# EAGLE design LiTE INO 2.2 rev. 01 (GND Plan) (EAGLE 9.0.1)
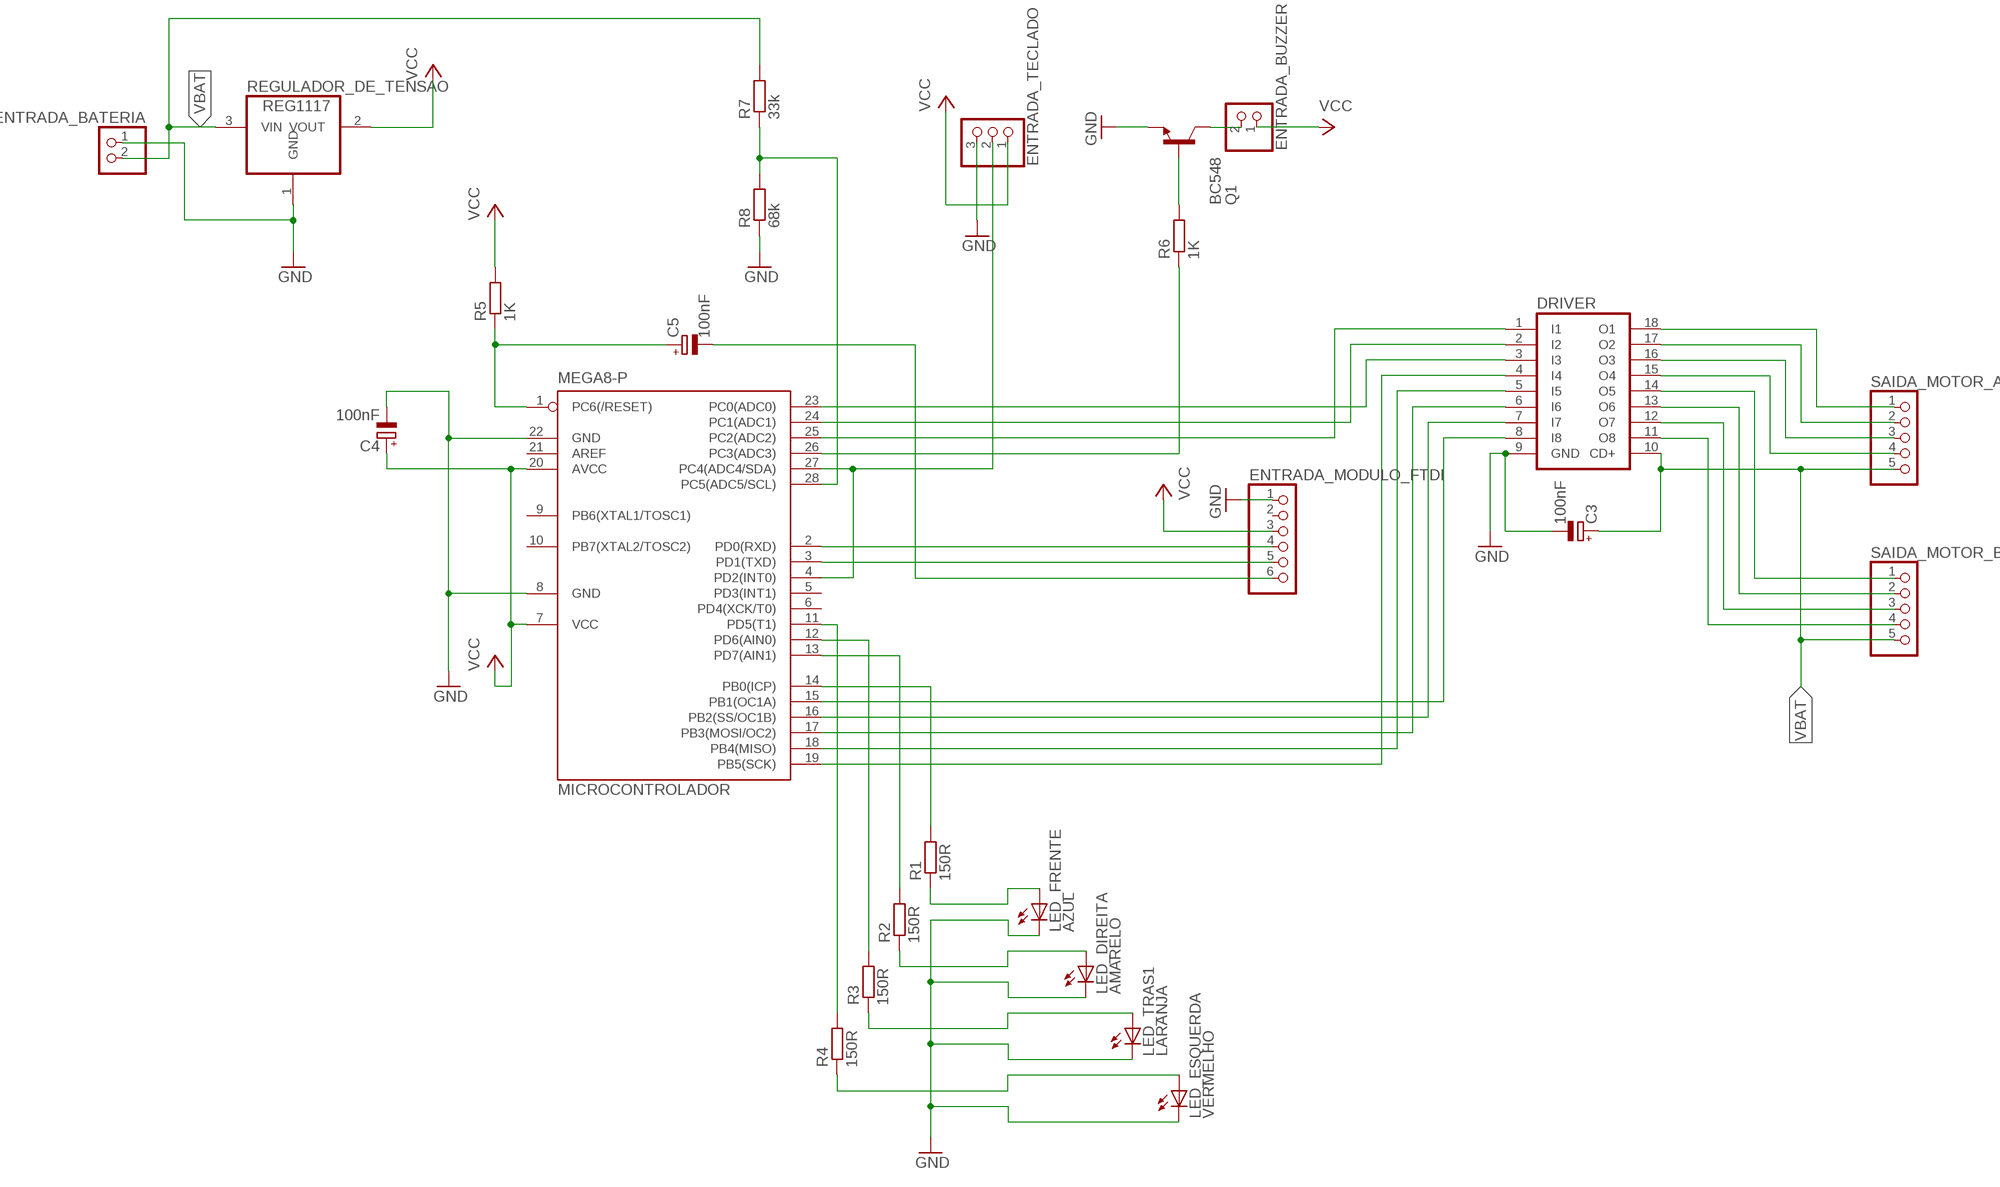
[diagram p0: schematic, sheet 1]

## Parts
C3  100nF  CPOL-EUE5-5  [E5-5]
C4  100nF  CPOL-EUE5-5  [E5-5]
C5  100nF  CPOL-EUE5-5  [E5-5]
DRIVER  ULN2803A  [DIL18]
ENTRADA_BATERIA  PINHD-1X2/90  [1X02/90]
ENTRADA_BUZZER  PINHD-1X2/90  [1X02/90]
ENTRADA_MODULO_FTDI  PINHD-1X6/90  [1X06/90]
ENTRADA_TECLADO  PINHD-1X3/90  [1X03/90]
LED_DIREITA  AMARELO  LED5MM  [LED5MM]
LED_ESQUERDA  VERMELHO  LED5MM  [LED5MM]
LED_FRENTE  AZUL  LED5MM  [LED5MM]
LED_TRAS1  LARANJA  LED5MM  [LED5MM]
MICROCONTROLADOR  MEGA8-P  [DIL28-3]
Q1  BC548  [TO92-EBC]
R1  150R  R-EU_0204/7  [0204/7]
R2  150R  R-EU_0204/7  [0204/7]
R3  150R  R-EU_0204/7  [0204/7]
R4  150R  R-EU_0204/7  [0204/7]
R5  1K  R-EU_0204/7  [0204/7]
R6  1K  R-EU_0204/7  [0204/7]
R7  33k  R-EU_0204/7  [0204/7]
R8  68k  R-EU_0204/7  [0204/7]
REGULADOR_DE_TENSAO  REG1117  [SOT223]
SAIDA_MOTOR_A  PINHD-1X5/90  [1X05/90]
SAIDA_MOTOR_B  PINHD-1X5/90  [1X05/90]

## Nets
GND: C3.- C4.- DRIVER.9(GND) ENTRADA_BATERIA.1 ENTRADA_MODULO_FTDI.1 ENTRADA_TECLADO.3 LED_DIREITA.K(C) LED_ESQUERDA.K(C) LED_FRENTE.K(C) LED_TRAS1.K(C) MICROCONTROLADOR.8(GND) MICROCONTROLADOR.22(GND) Q1.E R8.1 REGULADOR_DE_TENSAO.1(GND)
N$1: DRIVER.1(I1) MICROCONTROLADOR.25(PC2(ADC2))
N$2: DRIVER.2(I2) MICROCONTROLADOR.24(PC1(ADC1))
N$3: DRIVER.3(I3) MICROCONTROLADOR.23(PC0(ADC0))
N$4: DRIVER.4(I4) MICROCONTROLADOR.19(PB5(SCK))
N$5: DRIVER.5(I5) MICROCONTROLADOR.18(PB4(MISO))
N$6: DRIVER.6(I6) MICROCONTROLADOR.17(PB3(MOSI/OC2))
N$7: DRIVER.7(I7) MICROCONTROLADOR.16(PB2(SS/OC1B))
N$8: DRIVER.8(I8) MICROCONTROLADOR.15(PB1(OC1A))
N$9: LED_FRENTE.A R1.1
N$10: DRIVER.18(O1) SAIDA_MOTOR_A.1
N$11: DRIVER.17(O2) SAIDA_MOTOR_A.2
N$12: DRIVER.16(O3) SAIDA_MOTOR_A.3
N$13: DRIVER.15(O4) SAIDA_MOTOR_A.4
N$14: LED_DIREITA.A R2.1
N$15: DRIVER.14(O5) SAIDA_MOTOR_B.1
N$16: DRIVER.13(O6) SAIDA_MOTOR_B.2
N$17: DRIVER.12(O7) SAIDA_MOTOR_B.3
N$18: DRIVER.11(O8) SAIDA_MOTOR_B.4
N$19: LED_TRAS1.A R3.1
N$20: MICROCONTROLADOR.14(PB0(ICP)) R1.2
N$21: MICROCONTROLADOR.13(PD7(AIN1)) R2.2
N$22: MICROCONTROLADOR.12(PD6(AIN0)) R3.2
N$23: MICROCONTROLADOR.11(PD5(T1)) R4.2
N$24: ENTRADA_TECLADO.2 MICROCONTROLADOR.4(PD2(INT0)) MICROCONTROLADOR.27(PC4(ADC4/SDA))
N$25: ENTRADA_BUZZER.2 Q1.C
N$27: MICROCONTROLADOR.28(PC5(ADC5/SCL)) R7.1 R8.2
N$28: LED_ESQUERDA.A R4.1
N$29: MICROCONTROLADOR.26(PC3(ADC3)) R6.1
N$30: ENTRADA_MODULO_FTDI.4 MICROCONTROLADOR.2(PD0(RXD))
N$31: ENTRADA_MODULO_FTDI.5 MICROCONTROLADOR.3(PD1(TXD))
N$32: C5.- ENTRADA_MODULO_FTDI.6
N$33: C5.+ MICROCONTROLADOR.1(PC6(/RESET)) R5.1
N$34: Q1.B R6.2
VBAT: C3.+ DRIVER.10(CD+) ENTRADA_BATERIA.2 R7.2 REGULADOR_DE_TENSAO.3(VIN) SAIDA_MOTOR_A.5 SAIDA_MOTOR_B.5
VCC: C4.+ ENTRADA_BUZZER.1 ENTRADA_MODULO_FTDI.3 ENTRADA_TECLADO.1 MICROCONTROLADOR.7(VCC) MICROCONTROLADOR.20(AVCC) R5.2 REGULADOR_DE_TENSAO.2(VOUT)
Unconnected: ENTRADA_MODULO_FTDI.2 MICROCONTROLADOR.5(PD3(INT1)) MICROCONTROLADOR.6(PD4(XCK/T0)) MICROCONTROLADOR.9(PB6(XTAL1/TOSC1)) MICROCONTROLADOR.10(PB7(XTAL2/TOSC2)) MICROCONTROLADOR.21(AREF)

## Library data of the parts
C3-C5 = rcl:CPOL-EU: POLARIZED CAPACITOR, European symbol; SPICEPREFIX: C
DRIVER = uln-udn:ULN2803A: DRIVER ARRAY
ENTRADA_BATERIA ENTRADA_BUZZER = pinhead:PINHD-1X2: PIN HEADER
ENTRADA_MODULO_FTDI = pinhead:PINHD-1X6: PIN HEADER
ENTRADA_TECLADO = pinhead:PINHD-1X3: PIN HEADER
LED_DIREITA LED_ESQUERDA LED_FRENTE LED_TRAS1 = led:LED: LED OSRAM: - CHIPLED LG R971, LG N971, LY N971, LG Q971, LY Q971, LO R971, LY R971 LH N974, LH R974 LS Q976, LO Q976, LY Q976 LO Q996 - Hyper CHIPLED LW Q18S LB Q993, LB Q99A, LB R99A - SideLED LS A670, LO A670, LY A670, LG A670, LP A670 LB A673, LV A673, LT A673, LW A673 LH A674 LY A675 LS A676, LA A676, LO A676, LY A676, LW A676 LS A679, LY A679, LG A679 - Hyper Micro SIDELED® LS Y876, LA Y876, LO Y876, LY Y876 LT Y87S - SmartLED LW L88C, LW L88S LB L89C, LB L89S, LG L890 LS L89K, LO L89K, LY L89K LS L896, LA L896, LO L896, LY L896 - TOPLED LS T670, LO T670, LY T670, LG T670, LP T670 LSG T670, LSP T670, LSY T670, LOP T670, LYG T670 LG T671, LOG T671, LSG T671 LB T673, LV T673, LT T673, LW T673 LH T674 LS T676, LA T676, LO T676, LY T676, LB T676, LH T676, LSB T676, LW T676 LB T67C, LV T67C, LT T67C, LS T67K, LO T67K, LY T67K, LW E67C LS E67B, LA E67B, LO E67B, LY E67B, LB E67C, LV E67C, LT E67C LW T67C LS T679, LY T679, LG T679 LS T770, LO T770, LY T770, LG T770, LP T770 LB T773, LV T773, LT T773, LW T773 LH T774 LS E675, LA E675, LY E675, LS T675 LS T776, LA T776, LO T776, LY T776, LB T776 LHGB T686 LT T68C, LB T68C - Hyper Mini TOPLED® LB M676 - Mini TOPLED Santana® LG M470 LS M47K, LO M47K, LY M47K Source: http://www.osram.convergy.de LUXEON: - LUMILED® LXK2-PW12-R00, LXK2-PW12-S00, LXK2-PW14-U00, LXK2-PW14-V00 LXK2-PM12-R00, LXK2-PM12-S00, LXK2-PM14-U00 LXK2-PE12-Q00, LXK2-PE12-R00, LXK2-PE12-S00, LXK2-PE14-T00, LXK2-PE14-U00 LXK2-PB12-K00, LXK2-PB12-L00, LXK2-PB12-M00, LXK2-PB14-N00, LXK2-PB14-P00, LXK2-PB14-Q00 LXK2-PR12-L00, LXK2-PR12-M00, LXK2-PR14-Q00, LXK2-PR14-R00 LXK2-PD12-Q00, LXK2-PD12-R00, LXK2-PD12-S00 LXK2-PH12-R00, LXK2-PH12-S00 LXK2-PL12-P00, LXK2-PL12-Q00, LXK2-PL12-R00 Source: www.luxeon.com KINGBRIGHT: KA-3528ASYC Source: www.kingbright.com
MICROCONTROLADOR = atmel:MEGA8-P: MICROCONTROLLER 8 Kbytes FLASH, 1 kbytes SRAM, 512 bytes EEPROM, USART, 4-channel 10 bit ADC, 2-channel 8 bit ADC Pin compatible with Atmega48, ATMega88, ATMega168 Source: avr.lbr; OC_FARNELL: unknown; OC_NEWARK: unknown
Q1 = transistor-npn:BC548*: NPN Transistor
R1-R8 = resistor:R-EU_: RESISTOR, European symbol
REGULADOR_DE_TENSAO = burr-brown:REG1117: 800mA and 1A Low Dropout (LDO) Positive Regulator 1.8V, 2.5V, 2.85V, 3.3V, 5V, and Adj; MPN: REG1117; OC_FARNELL: 1097566; OC_NEWARK: 14P6981
SAIDA_MOTOR_A SAIDA_MOTOR_B = pinhead:PINHD-1X5: PIN HEADER

## Board
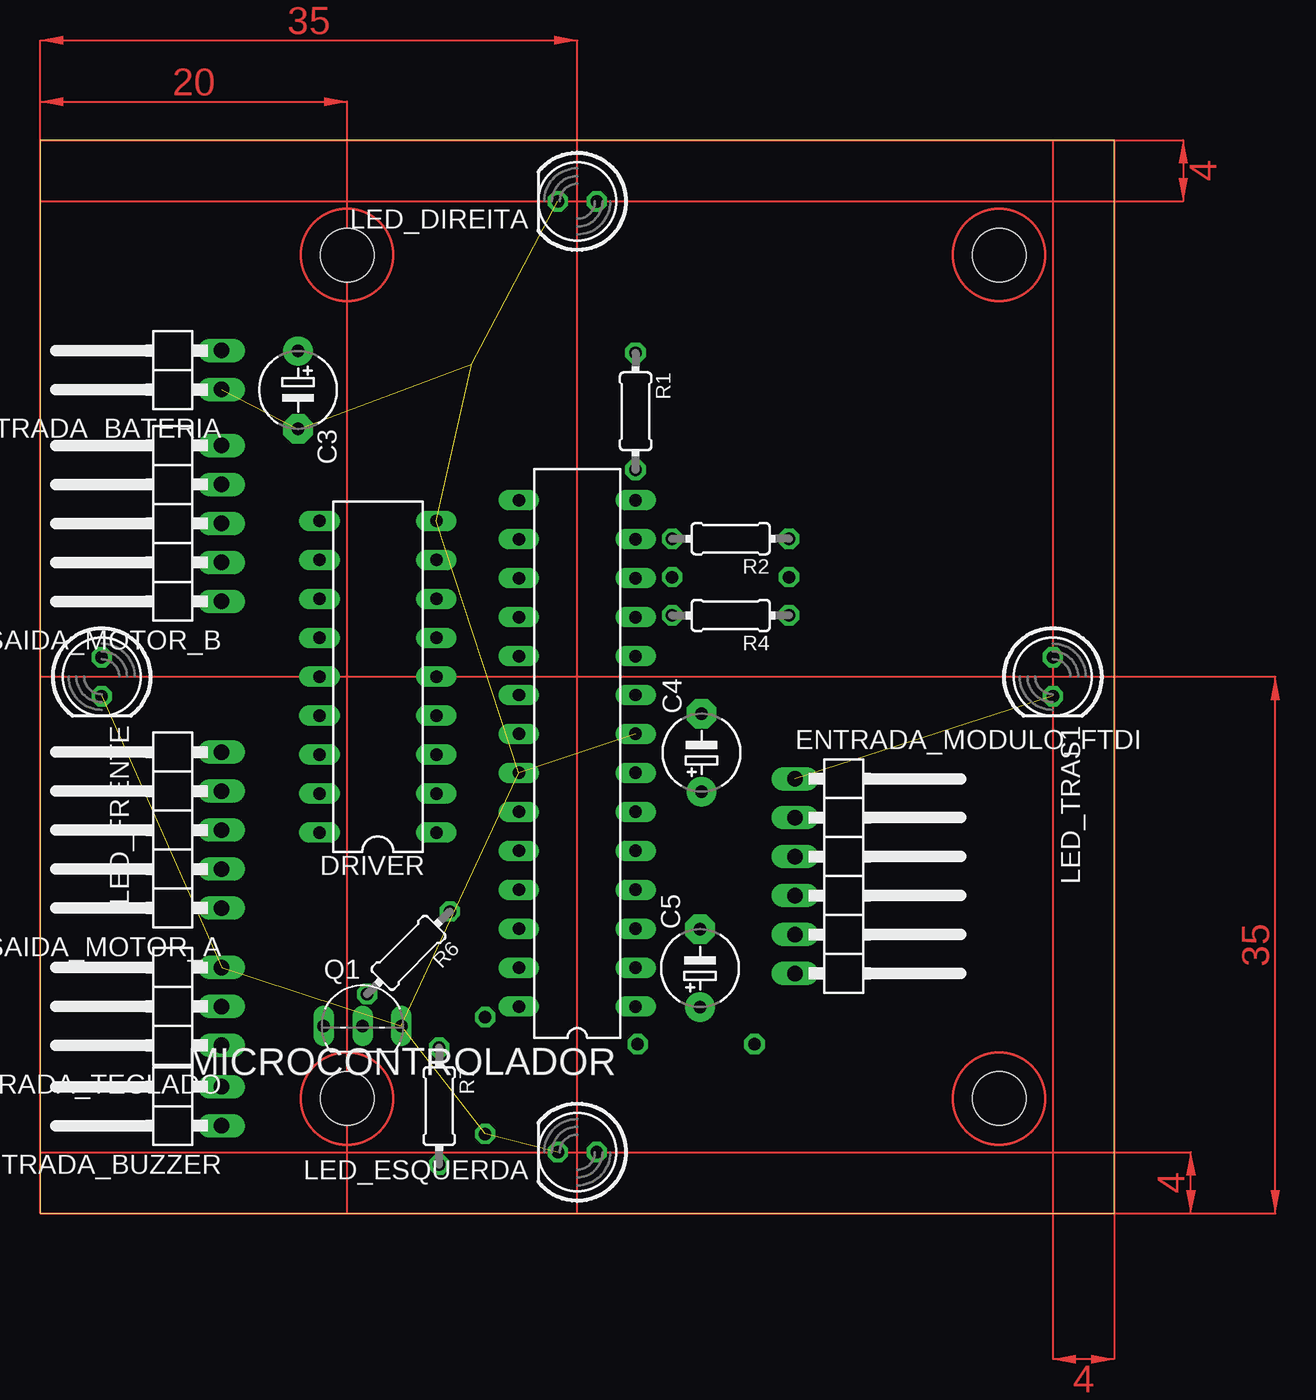
[diagram p1: board, top side]
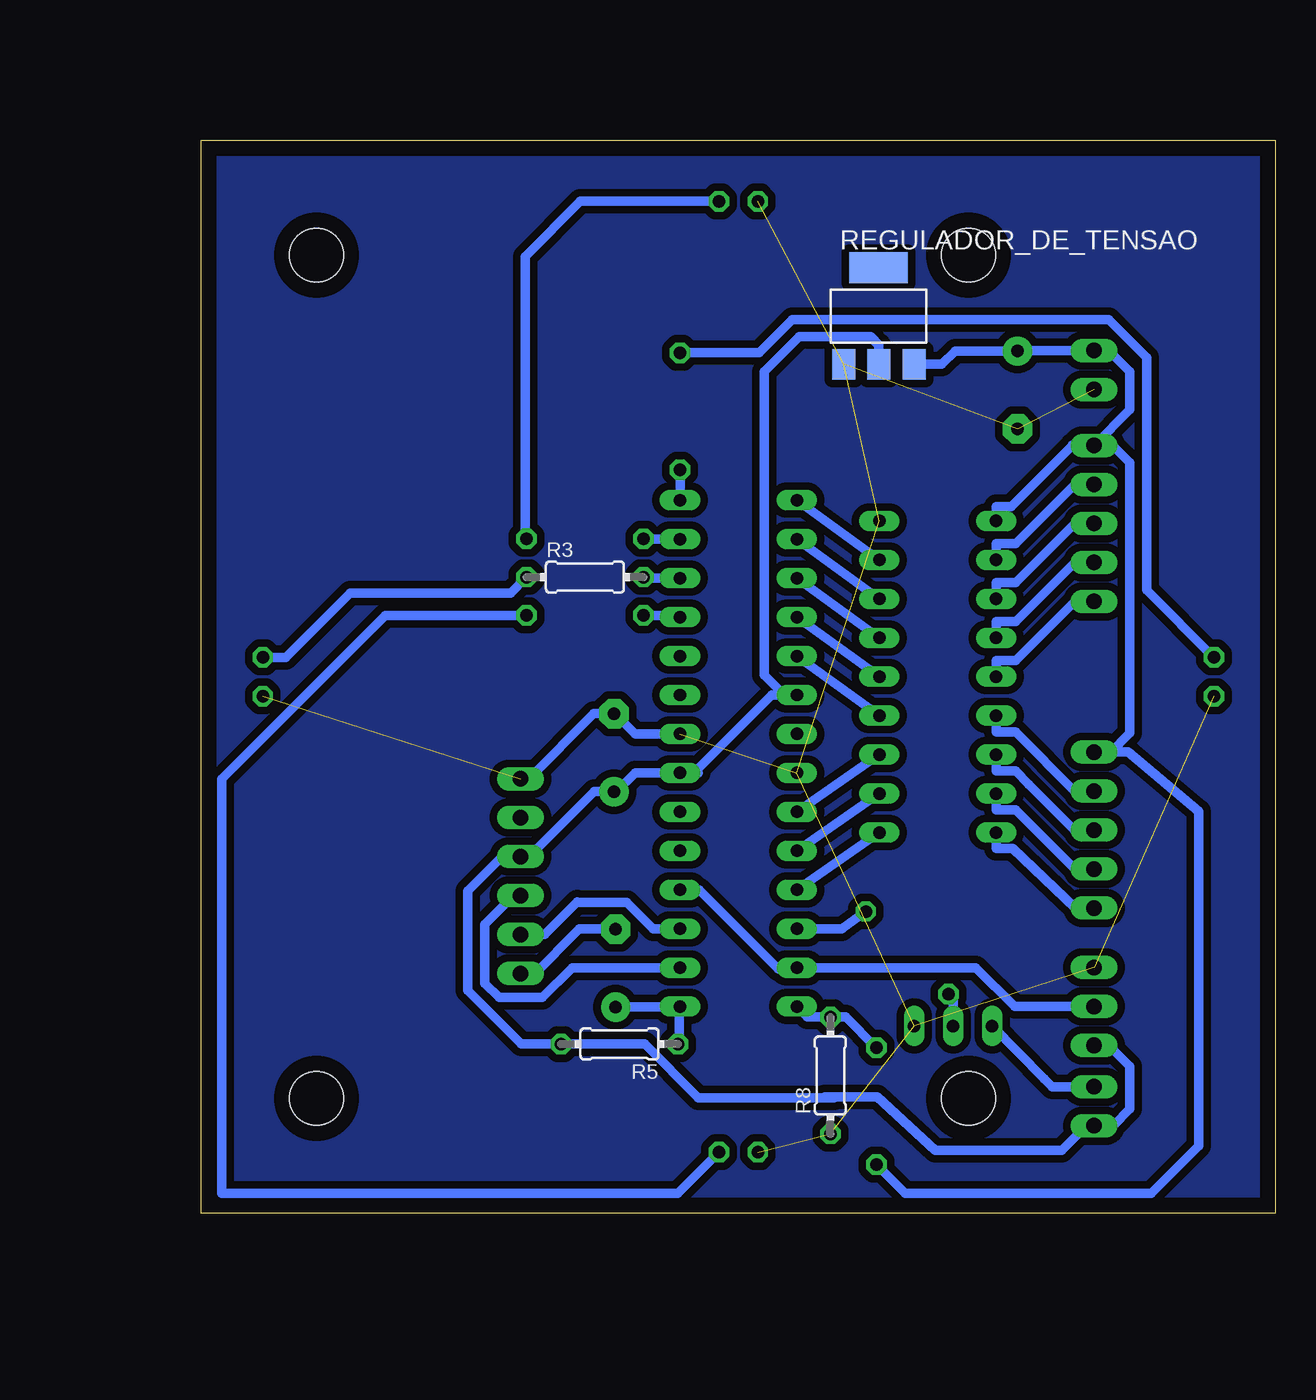
[diagram p2: board, bottom side, seen from below]

Size 70 x 70 mm. Coordinates in mm from the lower left corner, seen from the top.
Outline: 0,0 70,0 70,70 0,70 0,0
Copper layers (1*16): Top 0.035mm / dielectric 1.5mm / Bottom 0.035mm
Design rules "default *": minimum track width 6mil, minimum drill 0.35mm, track to track 0.5mm, track to pad 0.5mm, pad to pad 0.5mm, via to via 0.5mm, smd to smd 6mil, copper to edge 40mil, drill to drill 6mil, minimum pad ring 10mil, minimum via ring 8mil, stop-mask expansion 4mil, vias tented up to drill 0mil, thermal gap 10mil
Holes 3.5 mm at 62.5,7.5 20,7.5 20,62.5 62.5,62.5

### Footprints (pad centres in the part's own frame; a part is rotated, then mirrored left to right if it is on the bottom)
E5-5 = drill 0.813 pad 1.905: + -2.54,0 | drill 0.813 pad 1.905 octagon: - 2.54,0
DIL18 = drill 0.813 long: 1 -10.16,-3.81; 2 -7.62,-3.81; 3 -5.08,-3.81; 4 -2.54,-3.81; 5 0,-3.81; 6 2.54,-3.81; 7 5.08,-3.81; 8 7.62,-3.81; 9 10.16,-3.81; 10 10.16,3.81; 11 7.62,3.81; 12 5.08,3.81; 13 2.54,3.81; 14 0,3.81; 15 -2.54,3.81; 16 -5.08,3.81; 17 -7.62,3.81; 18 -10.16,3.81
1X02/90 = drill 1.016 long: 1 -1.27,-3.81; 2 1.27,-3.81
1X06/90 = drill 1.016 long: 1 -6.35,-3.81; 2 -3.81,-3.81; 3 -1.27,-3.81; 4 1.27,-3.81; 5 3.81,-3.81; 6 6.35,-3.81
1X03/90 = drill 1.016 long: 1 -2.54,-3.81; 2 0,-3.81; 3 2.54,-3.81
LED5MM = drill 0.813 octagon: A -1.27,0; K 1.27,0
DIL28-3 = drill 0.813 long: 1 -16.51,-3.81; 2 -13.97,-3.81; 3 -11.43,-3.81; 4 -8.89,-3.81; 5 -6.35,-3.81; 6 -3.81,-3.81; 7 -1.27,-3.81; 8 1.27,-3.81; 9 3.81,-3.81; 10 6.35,-3.81; 11 8.89,-3.81; 12 11.43,-3.81; 13 13.97,-3.81; 14 16.51,-3.81; 15 16.51,3.81; 16 13.97,3.81; 17 11.43,3.81; 18 8.89,3.81; 19 6.35,3.81; 20 3.81,3.81; 21 1.27,3.81; 22 -1.27,3.81; 23 -3.81,3.81; 24 -6.35,3.81; 25 -8.89,3.81; 26 -11.43,3.81; 27 -13.97,3.81; 28 -16.51,3.81
TO92-EBC = drill 0.813 long: B 0,-1.27; C -2.54,-1.27; E 2.54,-1.27
0204/7 = drill 0.813 octagon: 1 -3.81,0; 2 3.81,0
SOT223 = smd 1.499 x 2.007: 1 -2.261,-3.15; 2 0.025,-3.15; 3 2.311,-3.15 | smd 3.81 x 2.007: 4 0,3.15
1X05/90 = drill 1.016 long: 1 -5.08,-3.81; 2 -2.54,-3.81; 3 0,-3.81; 4 2.54,-3.81; 5 5.08,-3.81

### Placement (x,y rotation side)
C3  16.8,53.7 270 top
C4  43.1,30.05 90 top
C5  43,16 90 top
DRIVER  22,35 90 top
ENTRADA_BATERIA  8,55 90 top
ENTRADA_BUZZER  8,7 90 top
ENTRADA_MODULO_FTDI  53,22 270 top
ENTRADA_TECLADO  8,13.5 90 top
LED_DIREITA  35,66 180 top
LED_ESQUERDA  35,4 180 top
LED_FRENTE  4,35 270 top
LED_TRAS1  66,35 270 top
MICROCONTROLADOR  35,30 90 top
Q1  21,13.5 0 top
R1  38.8,52.31 270 top
R2  45,44 180 top
R3  45,41.5 0 bottom
R4  45,39 180 top
R5  42.75,11.05 180 bottom
R6  24,17 225 top
R7  26,7 270 top
R8  29,9 90 bottom
REGULADOR_DE_TENSAO  25.86,58.52 0 bottom
SAIDA_MOTOR_A  8,25 90 top
SAIDA_MOTOR_B  8,45 90 top

### Tracks (layer width: path | path; a pad name or v marks a point on that pad's centre or on a via)
GND  (12 unrouted)
  Bottom 0.61: MICROCONTROLADOR.8 41.73,31.27 43.05,32.59 C4.- 44.41,32.59 48.7,28.3 49.14,28.3 ENTRADA_MODULO_FTDI.1
N$1
  Bottom 0.61: DRIVER.1 MICROCONTROLADOR.25
N$2
  Bottom 0.61: DRIVER.2 MICROCONTROLADOR.24
N$3
  Bottom 0.61: DRIVER.3 MICROCONTROLADOR.23
N$4
  Bottom 0.61: DRIVER.4 MICROCONTROLADOR.19
N$5
  Bottom 0.61: DRIVER.5 MICROCONTROLADOR.18
N$6
  Bottom 0.61: DRIVER.6 MICROCONTROLADOR.17
N$7
  Bottom 0.61: DRIVER.7 MICROCONTROLADOR.16
N$8
  Bottom 0.61: DRIVER.8 MICROCONTROLADOR.15
N$9
  Bottom 0.61: R1.1 33.65,56.12 31.48,58.29 10.85,58.29 8.37,55.81 8.37,40.64 LED_FRENTE.A
N$10
  Bottom 0.61: SAIDA_MOTOR_A.1 13,19.9 17.1,23.8 18.2,23.8 DRIVER.18
N$11
  Bottom 0.61: SAIDA_MOTOR_A.2 13,22.4 13.02,22.4 16.92,26.3 18.2,26.3 DRIVER.17
N$12
  Bottom 0.61: SAIDA_MOTOR_A.3 13.1,25 16.06,27.96 16.06,27.99 16.92,28.84 18.2,28.84 DRIVER.16
N$13
  Bottom 0.61: SAIDA_MOTOR_A.4 13,27.5 13.04,27.5 16.92,31.39 18.2,31.39 DRIVER.15
N$14
  Bottom 0.61: R2.1 48.57,44 48.9,44.33 48.9,62.4 45.3,66 LED_DIREITA.A
N$15
  Bottom 0.61: SAIDA_MOTOR_B.1 13.08,39.92 16.92,36.08 18.2,36.08 DRIVER.14
N$16
  Bottom 0.61: SAIDA_MOTOR_B.2 13.08,42.46 16.92,38.62 18.2,38.62 DRIVER.13
N$17
  Bottom 0.61: SAIDA_MOTOR_B.3 13.08,45 16.92,41.16 18.2,41.16 DRIVER.12
N$18
  Bottom 0.61: SAIDA_MOTOR_B.4 13.08,47.54 16.92,43.7 18.2,43.7 DRIVER.11
N$19
  Bottom 0.61: LED_TRAS1.A 64.5,36.27 60.3,40.47 54.4,40.47 54.05,40.47 49.84,40.47 R3.1
N$20
  Bottom 0.61: R1.2 MICROCONTROLADOR.14
N$21
  Bottom 0.61: MICROCONTROLADOR.13 41.16,43.97 R2.2
N$22
  Bottom 0.61: MICROCONTROLADOR.12 41.12,41.43 R3.2
N$23
  Bottom 0.61: MICROCONTROLADOR.11 38.92,39 R4.2
N$24
  Bottom 0.61: ENTRADA_TECLADO.2 17,13.5 19.53,16.03 MICROCONTROLADOR.27 31.27,15.95 32.4,15.95 37.56,21.11 MICROCONTROLADOR.4
N$25
  Bottom 0.61: Q1.C 15.05,8.77 14.55,8.27 ENTRADA_BUZZER.2
N$26
  pour Bottom (isolate 0.254): 0,0 70,0 70,70 0,70
N$27
  Bottom 0.61: R7.1 28,12.81 R8.2 30.51,12.81 MICROCONTROLADOR.28
N$28
  Bottom 0.61: LED_ESQUERDA.A 38.95,1.32 68.68,1.32 68.68,28.34 58.02,39 R4.1
N$29
  Bottom 0.61: R6.1 28.26,18.57 MICROCONTROLADOR.26
N$30
  Bottom 0.61: ENTRADA_MODULO_FTDI.4 49.63,20.73 51.52,18.84 51.52,15 50.6,14.08 47.78,14.08 45.83,16.03 MICROCONTROLADOR.2
N$31
  Bottom 0.61: ENTRADA_MODULO_FTDI.5 47.61,18.19 45.5,20.3 42.27,20.3 40.55,18.57 MICROCONTROLADOR.3
N$32
  Bottom 0.61: ENTRADA_MODULO_FTDI.6 49.04,15.5 48.4,15.5 45.36,18.54 C5.-
N$33
  Bottom 0.61: C5.+ 38.84,13.46 | 38.84,13.46 MICROCONTROLADOR.1 | R5.1 38.84,11.15 38.84,13.46
N$34
  Bottom 0.61: R6.2 21,14 Q1.B
VBAT
  Bottom 0.61: SAIDA_MOTOR_B.5 12.78,50.11 13.22,50.11 | SAIDA_MOTOR_B.5 9.48,52.41 9.48,54.88 10.87,56.27 ENTRADA_BATERIA.2 16.77,56.27 C3.+ 20.86,56.24 21.73,55.37 REGULADOR_DE_TENSAO.3 | SAIDA_MOTOR_B.5 10.58,50.08 9.48,48.98 9.48,31.32 10.8,30 10.88,30.08 SAIDA_MOTOR_A.5 9.58,30.08 5,26.2 5,4.4 8.08,1.32 24.13,1.32 R7.2 | SAIDA_MOTOR_B.5 13.22,50.08 17.2,46.1 18.2,46.1 18.19,46.09 DRIVER.10
VCC
  Bottom 0.508: REGULADOR_DE_TENSAO.2 25.84,55.9
  Bottom 0.61: REGULADOR_DE_TENSAO.2 25.84,56.63 26.38,57.18 31.02,57.18 33.32,54.88 33.32,35.12 32.01,33.81 MICROCONTROLADOR.20 32.82,33.81 37.9,28.73 | 28.7,7.6 25.94,7.6 22.17,4.13 13.91,4.13 12.31,5.73 ENTRADA_BUZZER.1 10.57,5.73 9.48,6.82 9.48,9.58 10.86,10.96 ENTRADA_TECLADO.1 | 28.7,7.6 29.38,7.6 | 37.9,28.73 MICROCONTROLADOR.7 41.73,28.73 42.95,27.51 C4.+ 44.39,27.51 48.63,23.27 ENTRADA_MODULO_FTDI.3 50.32,23.27 50.35,23.3 52.63,21.02 52.63,14.54 49.14,11.05 R5.2 41.1,11.05 37.6,7.55 28.75,7.55 28.7,7.6 | 37.9,28.73 37.63,28.73
(copper drawn outside any net)
  shapes: Top area x6, Top circle x4